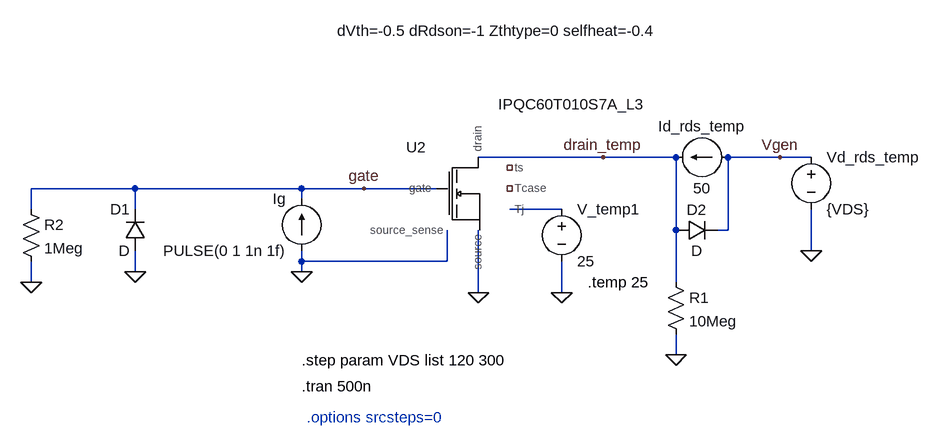
[diagram p0: schematic Si_MOSFET_gate_charge.asc]
Si_MOSFET_gate_charge.asc, the LTspice schematic file:
Version 4.1
SHEET 1 888 1272
WIRE 384 752 192 752
WIRE 496 752 384 752
WIRE 656 752 576 752
WIRE 704 752 656 752
WIRE -336 800 -496 800
WIRE -80 800 -336 800
WIRE 16 800 -80 800
WIRE 128 800 16 800
WIRE -80 816 -80 800
WIRE -496 832 -496 800
WIRE -336 832 -336 800
WIRE 320 832 240 832
WIRE 496 864 496 752
WIRE 576 864 576 752
WIRE 576 864 560 864
WIRE 704 896 704 832
WIRE -80 912 -80 896
WIRE 144 912 144 864
WIRE 144 912 -80 912
WIRE -336 928 -336 896
WIRE -80 928 -80 912
WIRE -496 944 -496 912
WIRE 496 944 496 864
WIRE 192 960 192 864
WIRE 320 960 320 912
WIRE 496 1056 496 1024
FLAG -80 928 0
FLAG 192 960 0
FLAG 320 960 0
FLAG 704 896 0
FLAG 384 752 drain_temp
FLAG 16 800 gate
FLAG 496 1056 0
FLAG 656 752 Vgen
FLAG -496 944 0
FLAG -336 928 0
SYMBOL IPQC60T010S7_L3 192 816 R0
WINDOW 3 144 -161 Top 2
WINDOW 39 30 -274 Top 2
SYMATTR InstName U2
SYMATTR SpiceLine dVth=-0.5 dRdson=-1 Zthtype=0 selfheat=-0.4
SYMBOL voltage 320 816 R0
WINDOW 123 0 0 Left 0
WINDOW 39 0 0 Left 0
SYMATTR InstName V_temp1
SYMATTR Value 25
SYMBOL current 576 752 R90
WINDOW 0 -32 40 VBottom 2
WINDOW 3 32 40 VTop 2
WINDOW 123 0 0 Left 0
WINDOW 39 0 0 Left 0
SYMATTR InstName Id_rds_temp
SYMATTR Value 50
SYMBOL diode 496 880 R270
WINDOW 0 32 32 VTop 2
WINDOW 3 0 32 VBottom 2
SYMATTR InstName D2
SYMBOL voltage 704 736 R0
SYMATTR InstName Vd_rds_temp
SYMATTR Value {VDS}
SYMBOL res 480 928 R0
SYMATTR InstName R1
SYMATTR Value 10Meg
SYMBOL current -80 896 R180
WINDOW 0 24 80 Left 2
WINDOW 3 24 0 Left 2
WINDOW 123 0 0 Left 0
WINDOW 39 0 0 Left 0
SYMATTR InstName Ig
SYMATTR Value PULSE(0 1 1n 1f)
SYMBOL res -512 816 R0
SYMATTR InstName R2
SYMATTR Value 1Meg
SYMBOL diode -320 896 R180
WINDOW 0 24 64 Left 2
WINDOW 3 24 0 Left 2
SYMATTR InstName D1
TEXT 360 944 Left 2 !.temp 25
TEXT -80 1064 Left 2 !.step param VDS list 120 300
TEXT -80 1104 Left 2 !.tran 500n
TEXT -72 1152 Left 2 ;.options srcsteps=0

The netlist it stands for:
* Si_MOSFET_gate_charge.asc
X§U2 drain_temp gate 0 0 NC_01 N001 NC_02 IPQC60T010S7A_L3 dVth=-0.5 dRdson=-1 Zthtype=0 selfheat=-0.4  ; pins drain gate source source_sense ts Tj Tcase
V_temp1 N001 0 25
Id_rds_temp Vgen drain_temp 50
D2 drain_temp Vgen D
Vd_rds_temp Vgen 0 {VDS}
R1 drain_temp 0 10Meg
Ig 0 gate PULSE(0 1 1n 1f)
R2 gate 0 1Meg
D1 0 gate D
.model D D
.lib standard.dio
.temp 25
.step param VDS list 120 300
.tran 500n
* .options srcsteps=0
.lib IFX_S7A_TS_600V.lib
.backanno
.end